# Altium schematic sheet v1.0.SchDoc
size 83 x 50 mm
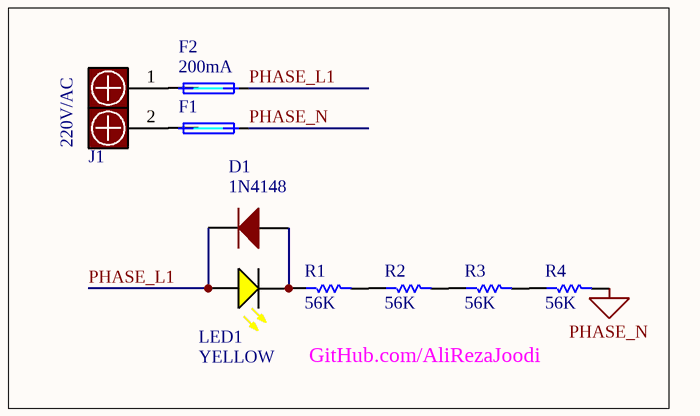
[diagram p0: v1.0.SchDoc]

## Parts
D1  1N4148  [SMD_DO-213AA]
F1  200mA  [SMD_1206]  (value not drawn)
F2  200mA  [SMD_1206]
J1  Connector1x2_Power_4Form  [1x2_P8.26]  (value not drawn)
LED1  YELLOW  [SMD_0805_YELLOW]
R1  56K  [SMD_0805]
R2  56K  [SMD_0805]
R3  56K  [SMD_0805]
R4  56K  [SMD_0805]

## Nets
PHASE_N: F1.2 R4.1
PHASE_L1: D1.2(K) F2.2 LED1.1(A)
NetD1_1: D1.1(A) LED1.2(K) R1.2
NetF1_1: F1.1 J1.2
NetF2_1: F2.1 J1.1
NetR1_1: R1.1 R2.2
NetR2_1: R2.1 R3.2
NetR3_1: R3.1 R4.2

## Notes on the sheet
- (near J1) 220V/AC
- GitHub.com/AliRezaJoodi

## Library data of the parts
D1 = Diode_2Form: Diode; Revision: July-2002: Re-released for DXP Platform.
F1 F2 = Fuse: 1_Part Number: 0437.250WRA; 1_Manufacturer: Littelfuse; 1_Link: https://eu.mouser.com/ProductDetail/Littelfuse/0437.250WRA?qs=sPbYRqrBIVmaapF4EZvohQ%3D%3D
J1 = Connector1x2_Power_4Form: Connector, Barrier Terminal Blocks, 2Pin; 1_Manufacturer: TE Connectivity; 1_Part Number: 1977477-2; 1_Link: https://eu.mouser.com/ProductDetail/TE-Connectivity/1977477-2?qs=94mdU9cNTDpZiO77z39FFw%3D%3D
LED1 = LED_YELLOW: LED; Revision: July-2002: Re-released for DXP Platform.
R1-R4 = Resistor: Resistor, 1/8W, 5%; Revision: July-2002: Re-released for DXP Platform.